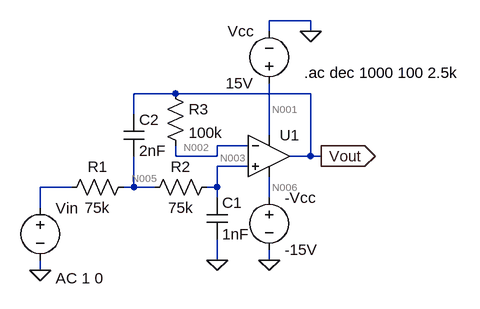
[diagram p0: schematic Q1.asc]
Q1.asc, the LTspice schematic file:
Version 4
SHEET 1 880 680
WIRE 336 -96 272 -96
WIRE 272 -80 272 -96
WIRE 336 -80 336 -96
WIRE 128 16 64 16
WIRE 336 16 128 16
WIRE 64 48 64 16
WIRE 272 80 272 0
WIRE 240 96 192 96
WIRE 128 112 128 96
WIRE 192 112 192 96
WIRE 192 112 128 112
WIRE 336 112 336 16
WIRE 336 112 304 112
WIRE 352 112 336 112
WIRE 240 128 192 128
WIRE -32 160 -80 160
WIRE 64 160 64 112
WIRE 64 160 48 160
WIRE 96 160 64 160
WIRE 192 160 192 128
WIRE 192 160 176 160
WIRE 192 176 192 160
WIRE 272 176 272 144
WIRE -80 192 -80 160
WIRE 192 272 192 240
WIRE 272 272 272 256
WIRE -80 288 -80 272
FLAG 336 -80 0
FLAG 272 272 0
FLAG 192 272 0
FLAG -80 288 0
FLAG 352 112 Vout
IOPIN 352 112 Out
SYMBOL Opamps\\UniversalOpamp2 272 112 R0
SYMATTR InstName U1
SYMBOL res 64 144 R90
WINDOW 0 0 56 VBottom 2
WINDOW 3 32 56 VTop 2
SYMATTR InstName R1
SYMATTR Value 75k
SYMBOL res 192 144 R90
WINDOW 0 0 56 VBottom 2
WINDOW 3 32 56 VTop 2
SYMATTR InstName R2
SYMATTR Value 75k
SYMBOL res 112 0 R0
SYMATTR InstName R3
SYMATTR Value 100k
SYMBOL cap 176 176 R0
SYMATTR InstName C1
SYMATTR Value 1nF
SYMBOL cap 48 48 R0
SYMATTR InstName C2
SYMATTR Value 2nF
SYMBOL voltage -80 176 R0
WINDOW 123 24 124 Left 2
WINDOW 39 0 0 Left 0
SYMATTR InstName Vin
SYMATTR Value ""
SYMATTR Value2 AC 1 0
SYMBOL voltage 272 16 R180
WINDOW 0 24 96 Left 2
WINDOW 3 24 16 Left 2
SYMATTR InstName Vcc
SYMATTR Value 15V
SYMBOL voltage 272 160 R0
SYMATTR InstName -Vcc
SYMATTR Value -15V
TEXT 326 -16 Left 2 !.ac dec 1000 100 2.5k

The netlist it stands for:
* Q1.asc
XU1 N003 N002 N001 N006 Vout level.2 Avol=1Meg GBW=10Meg Slew=10Meg ilimit=25m rail=0 Vos=0 phimargin=45 en=0 enk=0 in=0 ink=0 Rin=500Meg  ; pins IN+ IN- V+ V- OUT
R1 N005 N004 75k
R2 N003 N005 75k
R3 Vout N002 100k
C1 N003 0 1nF
C2 Vout N005 2nF
Vin N004 0 AC 1 0
Vcc N001 0 15V
V§-Vcc N006 0 -15V
.ac dec 1000 100 2.5k
.lib UniversalOpamps2.sub
.backanno
.end

* Results of the author's LTspice run, read from the files saved beside the schematic
* Operating Point, zero values left out:
*   V(n001) = 15 V
*   V(n006) = -15 V
*   I(-vcc) = 1.498 mA
*   I(Vcc) = -1.498 mA
*   Ix(u1:3) = 1.498 mA
*   Ix(u1:4) = -1.498 mA
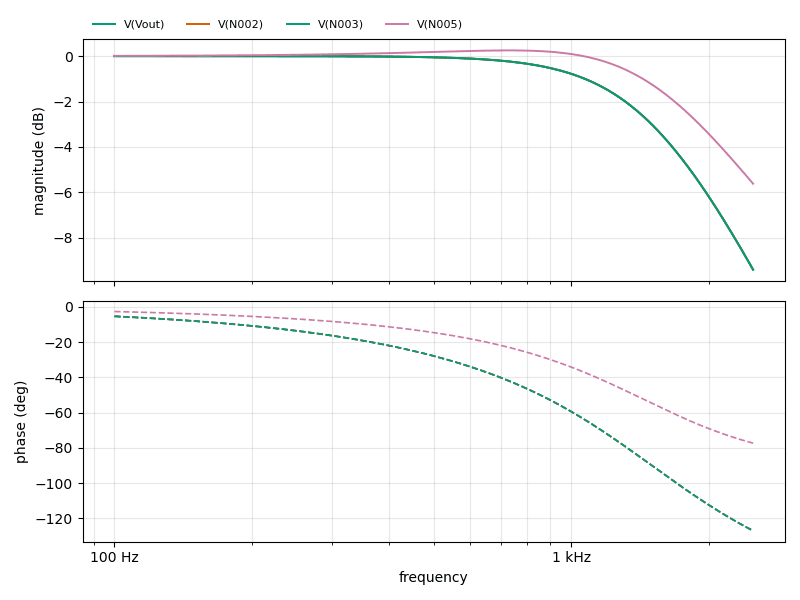
[diagram p1: AC Analysis of Q1.asc, plotted from the saved traces]
* AC Analysis, 1 run:
*   V(Vout): -0.00 dB at 100 Hz, -9.40 dB at 2.5 kHz, peak -0.00 dB at 100 Hz, 3 dB below the peak at 1.501 kHz
*   V(N002): -0.00 dB at 100 Hz, -9.40 dB at 2.5 kHz, peak -0.00 dB at 100 Hz, 3 dB below the peak at 1.501 kHz
*   V(N003): -0.00 dB at 100 Hz, -9.40 dB at 2.5 kHz, peak -0.00 dB at 100 Hz, 3 dB below the peak at 1.501 kHz
*   V(N005): 0.01 dB at 100 Hz, -5.62 dB at 2.5 kHz, peak 0.25 dB at 729.5 Hz, 3 dB below the peak at 1.854 kHz